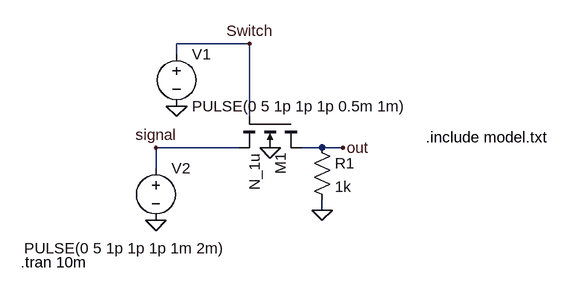
[diagram p0: schematic small_res.asc]
small_res.asc, the LTspice schematic file:
Version 4
SHEET 1 880 680
WIRE 176 0 64 0
WIRE 64 16 64 0
WIRE 176 112 176 0
WIRE 160 160 32 160
WIRE 288 160 256 160
WIRE 320 160 288 160
WIRE 32 192 32 160
WIRE 288 256 288 240
FLAG 208 160 0
FLAG 64 96 0
FLAG 32 272 0
FLAG 176 0 Switch
FLAG 32 160 signal
FLAG 320 160 out
FLAG 288 256 0
SYMBOL nmos4 256 112 R90
SYMATTR InstName M1
SYMATTR Value N_1u
SYMATTR Value2 l=0.9u w=1.8u
SYMBOL voltage 64 0 R0
WINDOW 123 0 0 Left 0
WINDOW 39 0 0 Left 0
SYMATTR InstName V1
SYMATTR Value PULSE(0 5 1p 1p 1p 0.5m 1m)
SYMBOL voltage 32 176 R0
WINDOW 3 -203 139 Left 2
WINDOW 123 0 0 Left 0
WINDOW 39 0 0 Left 0
SYMATTR Value PULSE(0 5 1p 1p 1p 1m 2m)
SYMATTR InstName V2
SYMBOL res 272 144 R0
SYMATTR InstName R1
SYMATTR Value 1k
TEXT -176 336 Left 2 !.tran 10m
TEXT 448 144 Left 2 !.include model.txt

The netlist it stands for:
* small_res.asc
M1 out Switch signal 0 N_1u l=0.9u w=1.8u
V1 Switch 0 PULSE(0 5 1p 1p 1p 0.5m 1m)
V2 signal 0 PULSE(0 5 1p 1p 1p 1m 2m)
R1 out 0 1k
.model NMOS NMOS
.model PMOS PMOS
.lib standard.mos
.tran 10m
.include model.txt
.backanno
.end